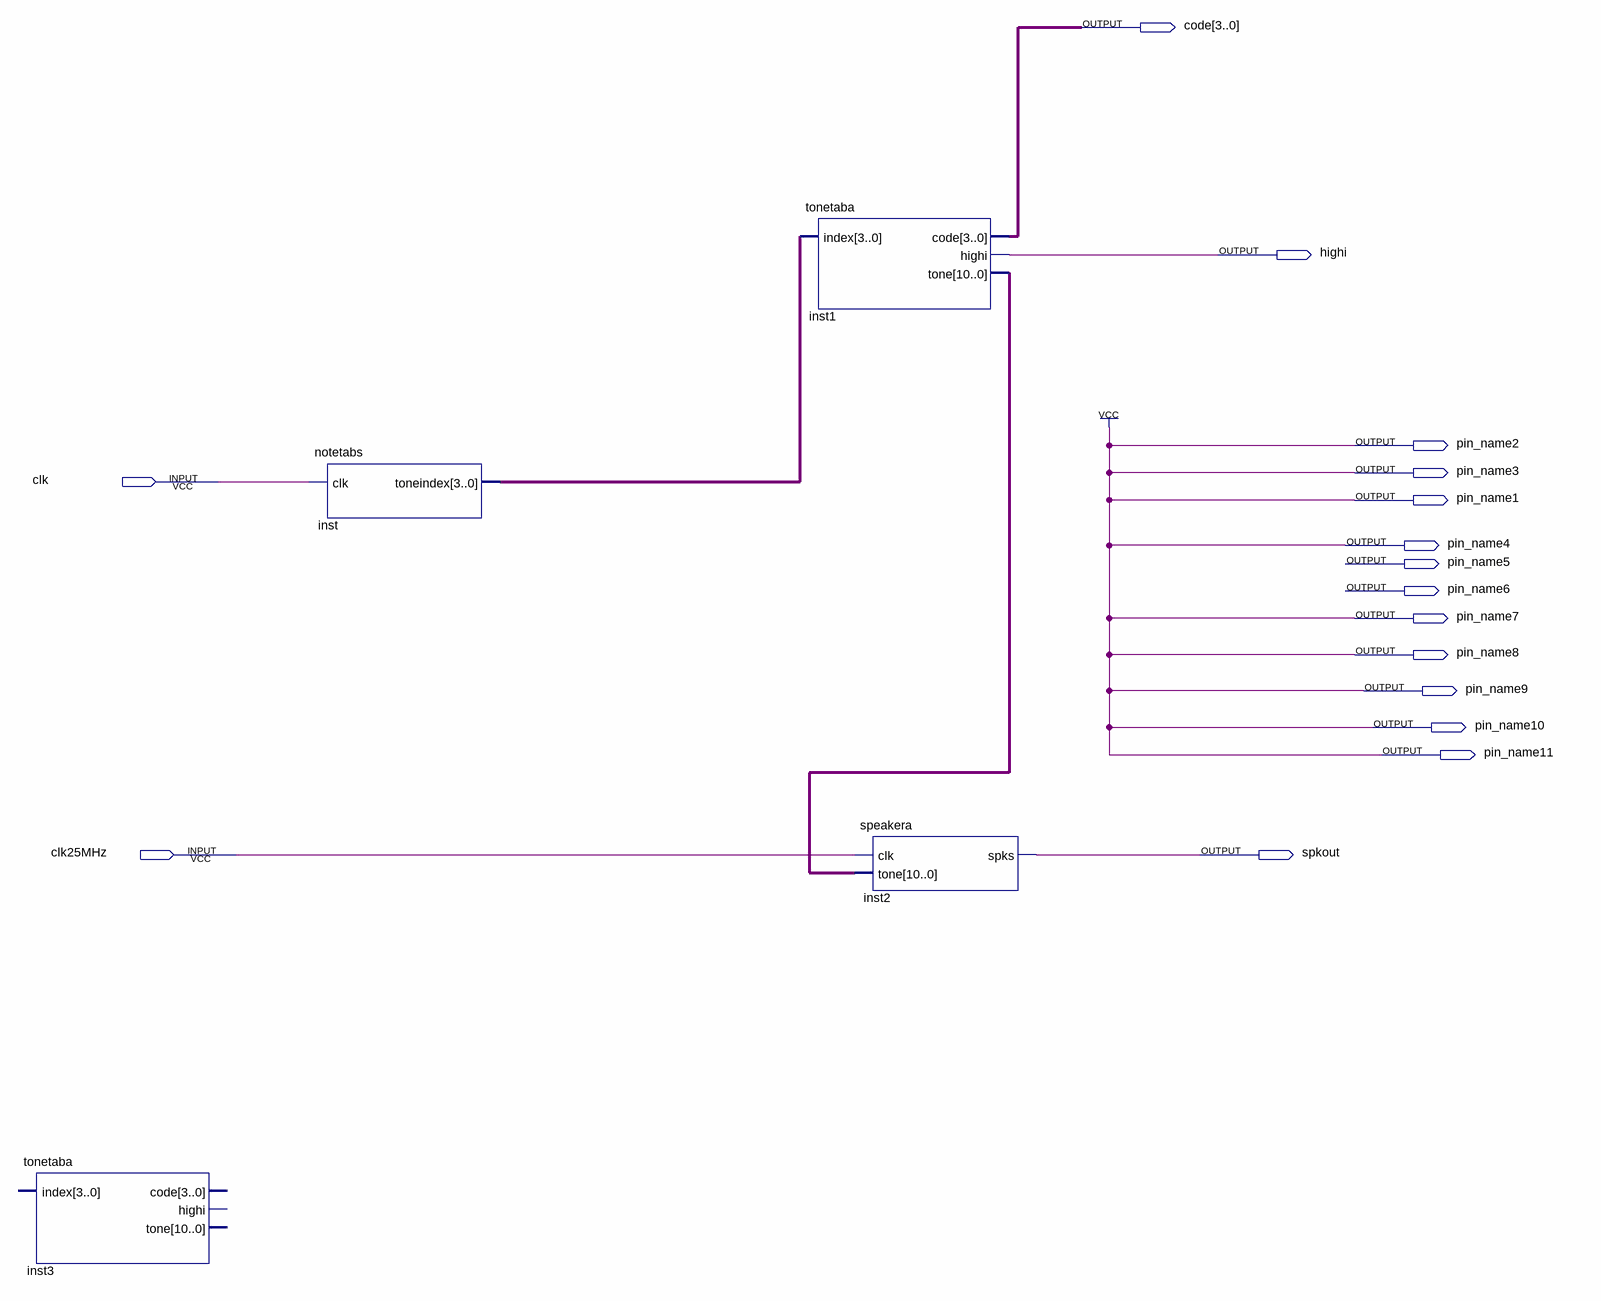
[diagram p0: schematic sheet]
// Quartus schematic yuanlitu.bdf as structural Verilog: 4 symbols, 16 pins
module yuanlitu (
  input  clk,
  input  clk25MHz,
  output [3:0] code,
  output highi,
  output pin_name2,
  output pin_name3,
  output pin_name1,
  output pin_name4,
  output pin_name5,
  output pin_name6,
  output pin_name7,
  output pin_name8,
  output pin_name9,
  output pin_name10,
  output pin_name11,
  output spkout
);

  wire [3:0] inst_toneindex;
  wire [10:0] inst1_tone;

  tonetaba inst3 ();  // open: index, code, highi, tone
  notetabs inst (.clk(clk), .toneindex(inst_toneindex));
  tonetaba inst1 (.index(inst_toneindex), .code(code), .highi(highi), .tone(inst1_tone));
  speakera inst2 (.clk(clk25MHz), .tone(inst1_tone), .spks(spkout));

  assign pin_name1 = 1'b1;
  assign pin_name2 = 1'b1;
  assign pin_name3 = 1'b1;
  assign pin_name4 = 1'b1;
  assign pin_name7 = 1'b1;
  assign pin_name8 = 1'b1;
  assign pin_name9 = 1'b1;
  assign pin_name10 = 1'b1;
  assign pin_name11 = 1'b1;
endmodule
